# EAGLE design loggerV3.0 (EAGLE 6.6.0)
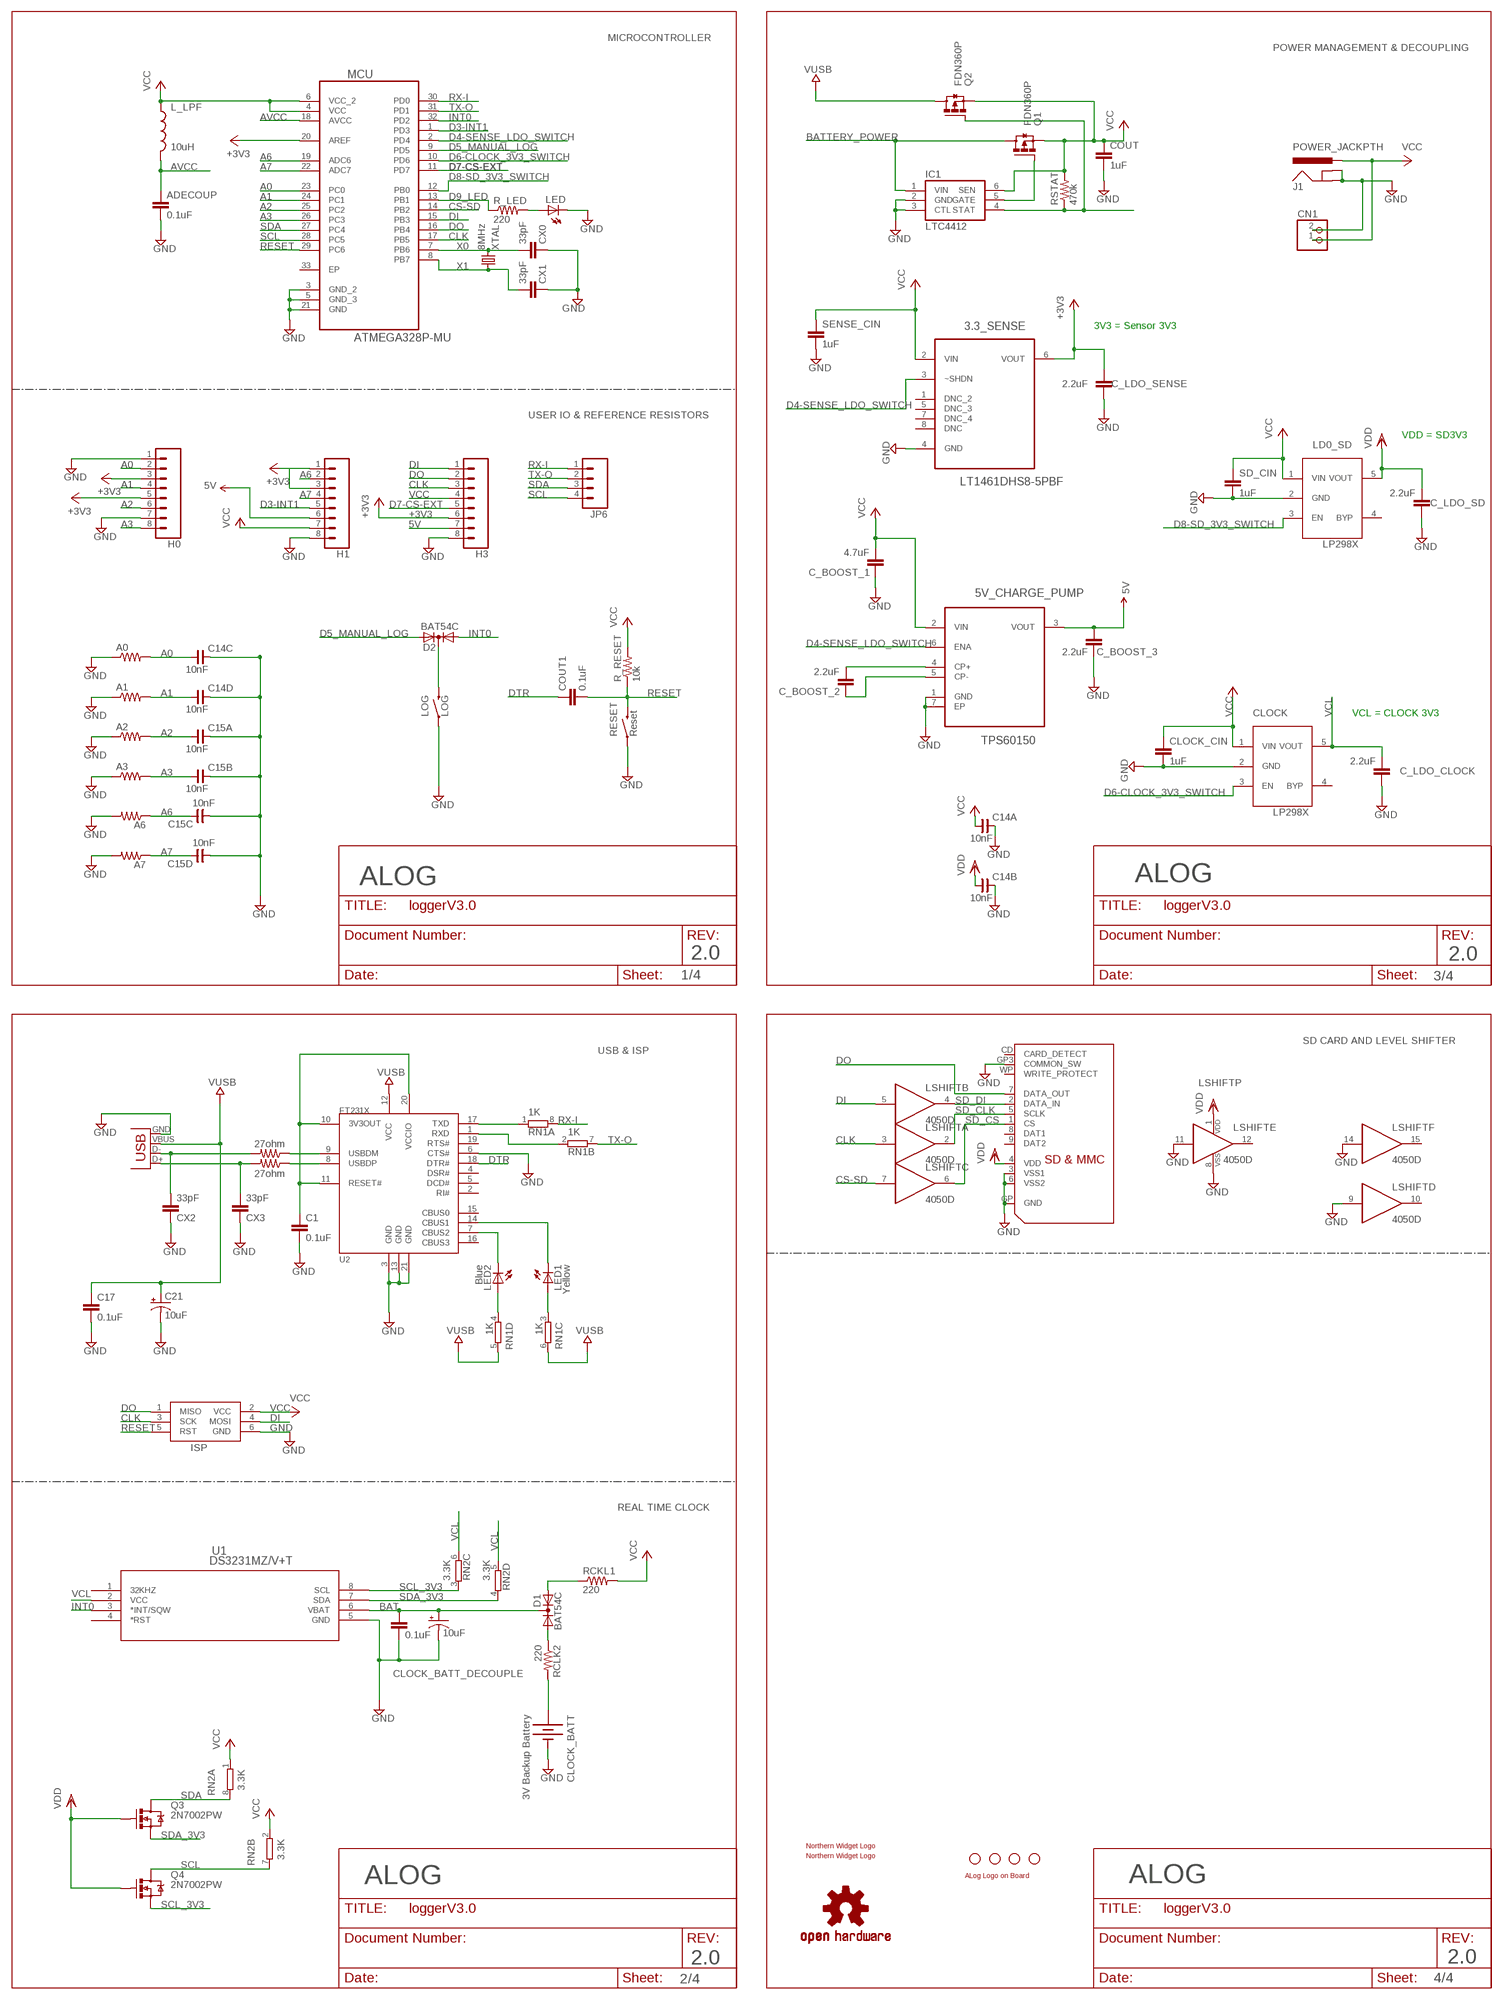
[diagram p0: schematic, sheet 1]

## Parts
3.3_SENSE  LT1461DHS8-5PBF  [SOIC127P600X175-8N]
5V_CHARGE_PUMP  TPS60150  TPS60150DRVR  [SON65P200X200X80-7N]
A0  R-US_0207/10  [0207/10]
A1  R-US_0207/10  [0207/10]
A2  R-US_0207/10  [0207/10]
A3  R-US_0207/10  [0207/10]
A6  R-US_0207/10  [0207/10]
A7  R-US_0207/10  [0207/10]
ADECOUP  0.1uF  C-EUC0603  [C0603]
C1  0.1uF  C-EUC0603  [C0603]
C14  10nF  CCA_ECJ-1206  [CECJ-1206]
C15  10nF  CCA_ECJ-1206  [CECJ-1206]
C17  0.1uF  C-EUC0603  [C0603]
C21  10uF  CAP_POL1206  [EIA3216]
C_BOOST_1  4.7uF  C-EUC0603  [C0603]
C_BOOST_2  2.2uF  C-EUC0603  [C0603]
C_BOOST_3  2.2uF  C-EUC0603  [C0603]
C_LDO_CLOCK  2.2uF  C-EUC0603  [C0603]
C_LDO_SD  2.2uF  C-EUC0603  [C0603]
C_LDO_SENSE  2.2uF  C-EUC0603  [C0603]
CLOCK  LP2985  LP298XS  [SOT23-5L]
CLOCK_BATT  3V Backup Battery  BATTERY12PTH  [BATTCON_12MM_PTH]
CLOCK_BATT_DECOUP  0.1uF  C-EUC0603  [C0603]
CLOCK_BATT_DECOUPLE  10uF  CAP_POL1206  [EIA3216]
CLOCK_CIN  1uF  C-EUC0603  [C0603]
CN1  JST_2PIN-THM  [JST-PH-2-THM]
COUT  1uF  C-EUC0603  [C0603]
COUT1  0.1uF  C-EUC0603  [C0603]
CX0  33pF  C-EUC0603  [C0603]
CX1  33pF  C-EUC0603  [C0603]
CX2  33pF  C-EUC0603  [C0603]
CX3  33pF  C-EUC0603  [C0603]
D1  BAT54C  DIODE_AC-CA_  [SOT23C]
D2  BAT54C  DIODE_AC-CA_  [SOT23C]
D+  27ohm  R-US_R0603  [R0603]
D-  27ohm  R-US_R0603  [R0603]
H0  M083.5MM-8  [SCREWTERMINAL-3.5MM-8]
H1  M083.5MM-8  [SCREWTERMINAL-3.5MM-8]
H3  M083.5MM-8  [SCREWTERMINAL-3.5MM-8]
IC1  LTC4412  LTC4412ES6  [TSOT23-6]
ISP  AVRISP-6  [AVRISP]
J1  POWER_JACKPTH  [POWER_JACK_PTH]
JP1  STAND-OFF  [STAND-OFF]
JP2  STAND-OFF  [STAND-OFF]
JP3  STAND-OFF  [STAND-OFF]
JP4  STAND-OFF  [STAND-OFF]
JP5  USB-B  USBPTH  [USB-B-PTH]
JP6  M04SCREW  [SCREWTERMINAL-3.5MM-4]
L_LPF  10uH  INDUCTOR0805  [0805]
LD0_SD  LP2985  LP298XS  [SOT23-5L]
LED  LED3MM  [LED3MM]
LED1  Yellow  LED0603  [LED-0603]
LED2  Blue  LED0603  [LED-0603]
LOG  LOG  SWITCH-MOMENTARY-2PTH  [TACTILE-PTH]
LOGO1  OSHW-LOGOM  [OSHW-LOGO-M]
LSHIFT  4050D  [SO16]
MCU  ATMEGA328P-MU  [QFN50P500X500X100-33N]
Q1  FDN360P  [SUPER-SOT3]
Q2  FDN360P  [SUPER-SOT3]
Q3  2N7002PW  MOSFET-NCHANNELSOT323  [SOT323]
Q4  2N7002PW  MOSFET-NCHANNELSOT323  [SOT323]
R_LED  220  R-US_R0603  [R0603]
R_RESET  10k  R-US_R0603  [R0603]
RCKL1  220  R-US_R0603  [R0603]
RCLK2  220  R-US_R0603  [R0603]
RESET  Reset  SWITCH-MOMENTARY-2PTH  [TACTILE-PTH]
RN1  1K  4R-N0603-ARC  [0603-ARC]
RN2  3.3K  4R-N0603-ARC  [0603-ARC]
RSTAT  470k  R-US_R0603  [R0603]
SD  SDMMC06132  [06132]
SD_CIN  1uF  C-EUC0603  [C0603]
SENSE_CIN  1uF  C-EUC0603  [C0603]
U1  DS3231MZ/V+T  [21-0041B_8]
U2  FT231X-Q  [QFN20]
U$1  NWLOGO  [NWLOGO]
U$2  ALOG_LOGO_V1_5.5MM  [ALOG_LOGO_V1_SMALL]
U$3  NWLOGO_MED  [NWLOGO_MED]
XTAL  8MHz  CRYSTALHC49UV  [HC49U-V]

## Nets
5V: 5V_CHARGE_PUMP.3(VOUT) C_BOOST_3.2 H1.6 H3.7
+3V3: 3.3_SENSE.6(VOUT) C_LDO_SENSE.2 H0.3 H0.5 H1.1 H1.3 H3.6 MCU.20(AREF)
A0: A0.2 C14.C1 H0.2 MCU.23(PC0)
A1: A1.2 C14.D1 H0.4 MCU.24(PC1)
A2: A2.2 C15.A1 H0.6 MCU.25(PC2)
A3: A3.2 C15.B1 H0.8 MCU.26(PC3)
A6: A6.1 C15.C2 H1.2 MCU.19(ADC6)
A7: A7.1 C15.D2 H1.4 MCU.22(ADC7)
AVCC: ADECOUP.1 L_LPF.2 MCU.18(AVCC)
BAT: CLOCK_BATT_DECOUP.1 CLOCK_BATT_DECOUPLE.A(+) D1.3(K) U1.6(VBAT)
BATTERY_POWER: IC1.1(VIN) Q1.3(D)
CLK: H3.3 ISP.3(SCK) LSHIFT.3(A:I) MCU.17(PB5)
CS-SD: LSHIFT.7(C:I) MCU.14(PB2)
D3-INT1: H1.5 MCU.1(PD3)
D4-SENSE_LDO_SWITCH: 3.3_SENSE.3(~SHDN) 5V_CHARGE_PUMP.6(ENA) MCU.2(PD4)
D5_MANUAL_LOG: D2.2(A2) MCU.9(PD5)
D6-CLOCK_3V3_SWITCH: CLOCK.3(EN) MCU.10(PD6)
D7-CS-EXT: H3.5 MCU.11(PD7)
D8-SD_3V3_SWITCH: LD0_SD.3(EN) MCU.12(PB0)
D9_LED: MCU.13(PB1) R_LED.1
DI: H3.1 ISP.4(MOSI) LSHIFT.5(B:I) MCU.15(PB3)
DO: H3.2 ISP.1(MISO) MCU.16(PB4) SD.7(DATA_OUT)
DTR: COUT1.1 U2.18(DTR#)
GND: 3.3_SENSE.4(GND) 5V_CHARGE_PUMP.1(GND) 5V_CHARGE_PUMP.7(EP) A0.1 A1.1 A2.1 A3.1 A6.2 A7.2 ADECOUP.2 C1.2 C14.A2 C14.B2 C14.C2 C14.D2 C15.A2 C15.B2 C15.C1 C15.D1 C17.2 C21.C(-) C_BOOST_1.1 C_BOOST_3.1 C_LDO_CLOCK.1 C_LDO_SD.1 C_LDO_SENSE.1 CLOCK.2(GND) CLOCK_BATT.GND(-) CLOCK_BATT_DECOUP.2 CLOCK_BATT_DECOUPLE.C(-) CLOCK_CIN.2 CN1.2 COUT.2 CX0.1 CX1.1 CX2.1 CX3.1 H0.1 H0.7 H1.8 H3.8 IC1.2(GND) IC1.3(CTL) ISP.6(GND) J1.GND J1.GNDBREAK JP5.GND LD0_SD.2(GND) LED.K(C) LOG.1 LSHIFT.8(P:VSS) LSHIFT.9(D:I) LSHIFT.11(E:I) LSHIFT.14(F:I) MCU.3(GND_2) MCU.5(GND_3) MCU.21(GND) RESET.1 SD.3(VSS1) SD.6(VSS2) SD.GP3(COMMON_SW) SD.GP(GND) SD_CIN.2 SENSE_CIN.2 U1.5(GND) U2.3(GND) U2.6(CTS#) U2.13(GND) U2.21(GND)
INT0: D2.1(A1) MCU.32(PD2) U1.3(*INT/SQW)
LED+: LED.A R_LED.2
N$1: D1.1(A1) RCLK2.1
N$2: CLOCK_BATT.VCC@1(+) RCLK2.2
N$3: CX3.2 D+.2 JP5.D+
N$4: CX2.2 D-.2 JP5.D-
N$5: LED2.A RN1.4
N$6: LED2.C U2.7(CBUS2)
N$7: IC1.4(STAT) Q2.1(G) RSTAT.1
N$8: IC1.5(GATE) Q1.1(G)
N$9: LED1.A RN1.3
N$10: LED1.C U2.14(CBUS1)
N$11: D2.3(K) LOG.3
N$13: D-.1 U2.9(USBDM)
N$14: 5V_CHARGE_PUMP.4(CP+) C_BOOST_2.2
N$15: 5V_CHARGE_PUMP.5(CP-) C_BOOST_2.1
N$16: D+.1 U2.8(USBDP)
N$17: C1.1 U2.10(3V3OUT) U2.11(RESET#) U2.20(VCCIO)
N$27: RN1.1 U2.17(TXD)
N$29: RN1.2 U2.1(RXD)
N$67: D1.2(A2) RCKL1.1
RESET: COUT1.2 ISP.5(RST) MCU.29(PC6) R_RESET.1 RESET.3
RX-I: JP6.1 MCU.30(PD0) RN1.8
SCL: JP6.4 MCU.28(PC5) Q4.3(D) RN2.7
SCL_3V3: Q4.2(S) RN2.3 U1.8(SCL)
SD_CLK: LSHIFT.2(A:O) SD.5(SCLK)
SD_CS: LSHIFT.6(C:O) SD.1(CS)
SD_DI: LSHIFT.4(B:O) SD.2(DATA_IN)
SDA: JP6.3 MCU.27(PC4) Q3.3(D) RN2.8
SDA_3V3: Q3.2(S) RN2.4 U1.7(SDA)
TX-O: JP6.2 MCU.31(PD1) RN1.7
VCC: 3.3_SENSE.2(VIN) 5V_CHARGE_PUMP.2(VIN) C14.A1 C_BOOST_1.2 CLOCK.1(VIN) CLOCK_CIN.1 CN1.1 COUT.1 H1.7 H3.4 IC1.6(SEN) ISP.2(VCC) J1.PWR L_LPF.1 LD0_SD.1(VIN) MCU.4(VCC) MCU.6(VCC_2) Q1.2(S) Q2.2(S) R_RESET.2 RCKL1.2 RN2.1 RN2.2 RSTAT.2 SD_CIN.1 SENSE_CIN.1
VCL: C_LDO_CLOCK.2 CLOCK.5(VOUT) RN2.5 RN2.6 U1.2(VCC)
VDD: C14.B1 C_LDO_SD.2 LD0_SD.5(VOUT) LSHIFT.1(P:VDD) Q3.1(G) Q4.1(G) SD.4(VDD)
VUSB: C17.1 C21.A(+) JP5.VBUS Q2.3(D) RN1.5 RN1.6 U2.12(VCC)
X0: CX0.2 MCU.7(PB6) XTAL.2
X1: CX1.2 MCU.8(PB7) XTAL.1
Unconnected: 3.3_SENSE.1(DNC_2) 3.3_SENSE.5(DNC_3) 3.3_SENSE.7(DNC_4) 3.3_SENSE.8(DNC) CLOCK.4(BYP) LD0_SD.4(BYP) LSHIFT.10(D:O) LSHIFT.12(E:O) LSHIFT.15(F:O) MCU.33(EP) SD.8(DAT1) SD.9(DAT2) SD.CD(CARD_DETECT) SD.WP(WRITE_PROTECT) U1.1(32KHZ) U1.4(*RST) U2.2(RI#) U2.4(DSR#) U2.5(DCD#) U2.15(CBUS0) U2.16(CBUS3) U2.19(RTS#)

## Notes on the sheet
- MICROCONTROLLER
- POWER MANAGEMENT & DECOUPLING
- 3V3 = Sensor 3V3
- USER IO & REFERENCE RESISTORS
- VDD = SD3V3
- VCL = CLOCK 3V3
- ALOG | ALOG
- 2.0 | 2.0
- 1/4 | 3/4
- SD CARD AND LEVEL SHIFTER
- USB & ISP
- REAL TIME CLOCK
- ALOG | ALOG
- 2.0 | 2.0
- 2/4 | 4/4

## Library data of the parts
3.3_SENSE = LTC_By_element14_Batch_1:LT1461DHS8-5PBF: Micropower Precision Low Dropout Series Voltage Reference Family; MPN: LT1461DHS8-5#PBF; OC_FARNELL: 1663431; OC_NEWARK: 57M4326; PACKAGE: SOIC-8; SUPPLIER: Linear Technology
5V_CHARGE_PUMP = ti_by_element14:TPS60150DRVR: Charge Pump Device; MPN: TPS60150DRVR; OC_FARNELL: -; OC_NEWARK: 45P8283; PACKAGE: SON-6; SUPPLIER: Texas Instruments
A0 A1-A3 A6 A7 R_LED = resistor:R-US_: RESISTOR, American symbol
ADECOUP C1 C17 C_BOOST_1-C_BOOST_3 C_LDO_CLOCK C_LDO_SD C_LDO_SENSE CX0 CX1-CX3 = resistor:C-EU: CAPACITOR, European symbol
C14 C15 = rc-master-smd:CCA_: CHIP CAP ARRAY
C21 CLOCK_BATT_DECOUPLE = SparkFun-Passives:CAP_POL: Capacitor Polarized These are standard SMD and PTH capacitors. Normally 10uF, 47uF, and 100uF in electrolytic and tantalum varieties. Always verify the external diameter of the through hole cap, it varies with capacity, voltage, and manufacturer. The EIA devices should be standard.
CLOCK LD0_SD = adafruit:LP298X
CLOCK_BATT = SparkFun:BATTERY: Battery Holders Various common sizes : AA, AAA, 20mm coin cell and 12mm coin cell.
CLOCK_BATT_DECOUP CLOCK_CIN COUT COUT1 SD_CIN SENSE_CIN = rcl:C-EU: CAPACITOR, European symbol
CN1 = adafruit:JST_2PIN: JST 2-Pin Connectors of various flavors SMT-RA (S2B-PH-SM4) 4UConnector #17311 SMT (B2B-PH-SM4) THM-RA (S2B-PH) THM (B2B-PH)
D1 D2 = semicon-smd-ipc:DIODE_AC-CA_: DUAL DIODE
D+ D- R_RESET RCKL1 RCLK2 RSTAT = rcl:R-US_: RESISTOR, American symbol
H0 H1 H3 = SparkFun:M08: Header 8 Standard 8-pin 0.1" header. Use with straight break away headers (SKU : PRT-00116), right angle break away headers (PRT-00553), swiss pins (PRT-00743), machine pins (PRT-00117), and female headers (PRT-00115).
IC1 = awickert:LTC4412*: Low Loss PowerPath Controller
ISP = adafruit:AVRISP: AVR ISP HEADER Standard 6 pin header for AVR programming
J1 = SparkFun:POWER_JACK: Power Jack This is the standard 5.5mm barrel jack for power. The PTH is the most common, proven, reliable, footprint. All others are experimental. The Slot footprint only works if the mill layer is transmitted to the PCB fab house so be warned. Spark Fun Electronics SKU : PRT-00119. Mating wall wart : TOL-00298 (and others)
JP1-JP4 = SparkFun:STAND-OFF: Stand Off This is the mechanical footprint for a #4 phillips button head screw. Use the keepout ring to avoid running the screw head into surrounding components. SKU : PRT-00447
JP5 = SparkFun-Connectors:USB: USB Connectors USB-B-PTH is fully proven SKU : PRT-00139/CONN-08278 USB-miniB is fully proven SKU : PRT-00587 USB-A-PCB is untested. USB-A-H is throughly reviewed, but untested. Spark Fun Electronics SKU : PRT-00437 USB-B-SMT is throughly reviewed, but untested. Needs silkscreen touching up. USB-A-S has not been used/tested USB-MB-H has not been used/tested USB-MICROB has been used. CONN-09505; PROD_ID: CONN-08278
JP6 = SparkFun-Connectors:M04: Header 4 Standard 4-pin 0.1" header. Use with straight break away headers (SKU : PRT-00116), right angle break away headers (PRT-00553), swiss pins (PRT-00743), machine pins (PRT-00117), and female headers (PRT-00115). Molex polarized connector foot print use with SKU : PRT-08231 with associated crimp pins and housings. 1MM SMD Version SKU: PRT-10208; PROD_ID: Combine 2x8399
L_LPF = SparkFun:INDUCTOR: Inductors Basic Inductor/Choke - 0603 and 1206. Footprints are not proven and vary greatly between part numbers.
LED = SparkFun:LED: LEDs Standard schematic elements and footprints for 5mm, 3mm, 1206, and 0603 sized LEDs. 5mm - Spark Fun Electronics SKU : COM-00529 (and others)
LED1 LED2 = SparkFun-LED:LED: LEDs Standard schematic elements and footprints for 5mm, 3mm, 1206, and 0603 sized LEDs. 5mm - Spark Fun Electronics SKU : COM-00529 (and others)
LOG RESET = SparkFun-Electromechanical:SWITCH-MOMENTARY-2: Various NO switches- pushbuttons, reed, etc; PROD_ID: SWCH-08441
LOGO1 = SparkFun-Aesthetics:OSHW-LOGO: Open Source Hardware Logo This logo indicates the piece of hardware it is found on incorporates a OSHW license and/or adheres to the definition of open source hardware found here: http://freedomdefined.org/OSHW
LSHIFT = 40xx:4050: Hex non-inverting BUFFER
MCU = Atmel_By_element14_Batch_1-00:ATMEGA328P-MU: Programmable Flash; MPN: ATMEGA328P-MU; OC_FARNELL: 1748522; OC_NEWARK: 26R2526; PACKAGE: QFN-32; SUPPLIER: Atmel
Q1 Q2 = transistor-power:FDN360P: Single P-Channel, PowerTrench (R) MOSFET Source: http://www.fairchildsemi.com/ds/FD/FDN360P.pdf
Q3 Q4 = SparkFun-DiscreteSemi:MOSFET-NCHANNEL: Generic NMOS footprint
RN1 RN2 = resistor-dil:4R-N: Array Chip Resistor Source: RS Component / Phycomp; OC_FARNELL: unknown; OC_NEWARK: unknown
SD = adafruit:SDMMC: SD MMC Card holder 4UCON part #06132 - easy to solder
U1 = Maxim-DS3231MZ_8-SOIC:DS3231MZ/V+T; MANUFACTURER_NAME: Maxim; MANUFACTURER_PART_NUMBER: DS3231MZ/V+T; VENDOR: Maxim
U2 = FT231X:FT231X
U$1 = awickert:NWLOGO
U$2 = awickert:ALOG_LOGO_V1_5.5MM
U$3 = awickert:NWLOGO_MED: Medium-sized Northern Widget logo
XTAL = SparkFun:CRYSTAL: Crystals Various standard crystals. Proven footprints. Spark Fun Electronics SKU : COM-00534

## Net classes
0 default: width 0.203 mm, drill 0.305 mm
1 power: width 0.305 mm, drill 0.508 mm
2 gnd: width 0.61 mm, drill 0.508 mm, clearance 0.203 mm
3 usbvcc: width 0.508 mm, drill 0.508 mm, clearance 0.152 mm
4 aref: width 0.406 mm

## Board
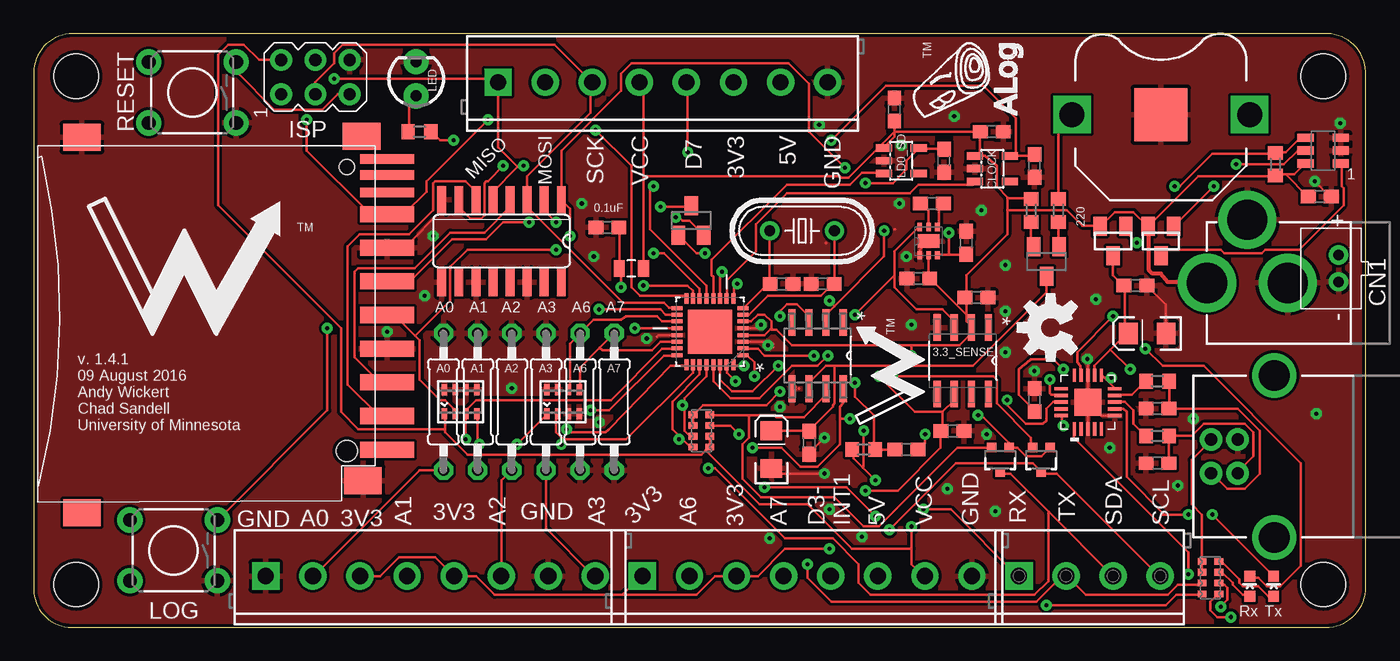
[diagram p1: board, top side]
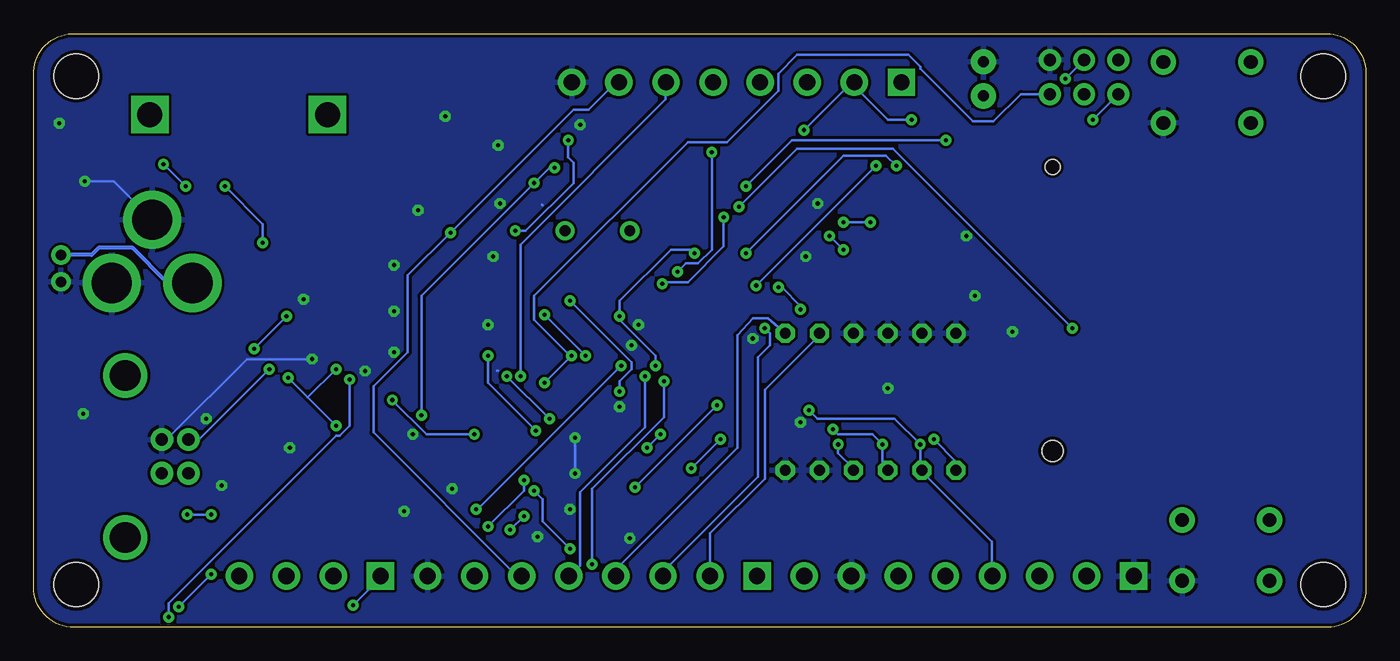
[diagram p2: board, bottom side, seen from below]

Size 99.05 x 44.12 mm. Coordinates in mm from the lower left corner, seen from the top.
Outline: 99.05,41.32 arc90 95.93,44.12 2.91,44.12 arc90 0,41.21 0,2.85 arc90 2.85,0 96.06,0 arc90 99.05,2.98 99.05,41.32
Copper layers (1*16): Top 0.035mm / dielectric 1.5mm / Bottom 0.035mm
Design rules "SparkFun *": minimum track width 8mil, minimum drill 12mil, track to track 8mil, track to pad 8mil, pad to pad 8mil, via to via 8mil, smd to smd 8mil, copper to edge 10mil, drill to drill 8mil, minimum pad ring 12mil, minimum via ring 10mil, stop-mask expansion 4mil, vias tented up to drill 25mil, thermal gap 10mil

### Footprints (pad centres in the part's own frame; a part is rotated, then mirrored left to right if it is on the bottom)
SOIC127P600X175-8N = smd 1.981 x 0.533: 1 -2.464,1.905; 2 -2.464,0.635; 3 -2.464,-0.635; 4 -2.464,-1.905; 5 2.464,-1.905; 6 2.464,-0.635; 7 2.464,0.635; 8 2.464,1.905
SON65P200X200X80-7N = smd 0.61 x 0.356: 1 -1.041,0.66; 2 -1.041,0; 3 -1.041,-0.66; 4 1.041,-0.66; 5 1.041,0; 6 1.041,0.66 | smd 0.991 x 1.6: 7 0,0
0207/10 = drill 0.813 octagon: 1 -5.08,0; 2 5.08,0
C0603 = smd 1.1 x 1: 1 -0.85,0; 2 0.85,0
CECJ-1206 = smd 0.406 x 0.813: A1 -1.2,-0.9; A2 -1.2,0.9; B1 -0.4,-0.9; B2 -0.4,0.9; C1 0.4,-0.9; C2 0.4,0.9; D1 1.2,-0.9; D2 1.2,0.9
EIA3216 = smd 1.4 x 1.6: A 1.4,0; C -1.4,0
SOT23-5L = smd 0.55 x 1.2: 1 -0.95,-1.3; 2 0,-1.3; 3 0.95,-1.3; 4 0.95,1.3; 5 -0.95,1.3
BATTCON_12MM_PTH = smd 3.962 x 3.962: GND 0,0 | drill 1.854 square: VCC@1 -6.604,0; VCC@2 6.604,0
JST-PH-2-THM = drill 0.8 pad 1.422: 1 1,0; 2 -1,0
SOT23C = smd 1 x 1.4: 1 -0.95,-1.1; 2 0.95,-1.1; 3 0,1.1
R0603 = smd 1 x 1.1: 1 -0.85,0; 2 0.85,0
SCREWTERMINAL-3.5MM-8 = drill 1.2 pad 2.032 square: 1 0,0 | drill 1.2 pad 2.032: 2 3.5,0; 3 7,0; 4 10.5,0; 5 14,0; 6 17.5,0; 7 21,0; 8 24.5,0
TSOT23-6 = smd 0.622 x 1.22: 1 -0.95,-1.31; 2 0,-1.31; 3 0.95,-1.31; 4 0.95,1.31; 5 0,1.31; 6 -0.95,1.31
AVRISP = drill 0.9 pad 1.626: 1 -1.27,2.54; 2 1.27,2.54; 3 -1.27,0; 4 1.27,0; 5 -1.27,-2.54; 6 1.27,-2.54
POWER_JACK_PTH = drill 2.997 pad 4.318: GND 0,7.7; GNDBREAK 4.7,10.7; PWR 0,13.7
STAND-OFF = hole 3.302: 0,0
USB-B-PTH = drill 0.914 pad 1.676: D+ 0,1.25; D- 1.981,1.25; GND 0,-1.25; VBUS 1.981,-1.25 | drill 2.286: S1 -2.718,-6.02; S2 -2.718,6.02
SCREWTERMINAL-3.5MM-4 = drill 1.2 pad 2.032 square: 1 0,0 | drill 1.2 pad 2.032: 2 3.5,0; 3 7,0; 4 10.5,0
0805 = smd 0.8 x 1.2: 1 -0.9,0; 2 0.9,0
LED3MM = drill 0.813 pad 1.88: A -1.27,0; K 1.27,0
LED-0603 = smd 0.8 x 0.8: A 0,-0.75; C 0,0.75
TACTILE-PTH = drill 1.016 pad 1.88: 1 -3.251,2.261; 2 3.251,2.261; 3 -3.251,-2.261; 4 3.251,-2.261
SO16 = smd 0.66 x 2.032: 1 -4.445,-3.073; 2 -3.175,-3.073; 3 -1.905,-3.073; 4 -0.635,-3.073; 5 0.635,-3.073; 6 1.905,-3.073; 7 3.175,-3.073; 8 4.445,-3.073; 9 4.445,3.073; 10 3.175,3.073; 11 1.905,3.073; 12 0.635,3.073; 13 -0.635,3.073; 14 -1.905,3.073; 15 -3.175,3.073; 16 -4.445,3.073
QFN50P500X500X100-33N = smd 0.813 x 0.305: 1 -2.464,1.753; 2 -2.464,1.245; 3 -2.464,0.762; 4 -2.464,0.254; 5 -2.464,-0.254; 6 -2.464,-0.762; 7 -2.464,-1.245; 8 -2.464,-1.753; 17 2.464,-1.753; 18 2.464,-1.245; 19 2.464,-0.762; 20 2.464,-0.254; 21 2.464,0.254; 22 2.464,0.762; 23 2.464,1.245; 24 2.464,1.753 | smd 0.305 x 0.813: 9 -1.753,-2.464; 10 -1.245,-2.464; 11 -0.762,-2.464; 12 -0.254,-2.464; 13 0.254,-2.464; 14 0.762,-2.464; 15 1.245,-2.464; 16 1.753,-2.464; 25 1.753,2.464; 26 1.245,2.464; 27 0.762,2.464; 28 0.254,2.464; 29 -0.254,2.464; 30 -0.762,2.464; 31 -1.245,2.464; 32 -1.753,2.464 | smd 3.251 x 3.251: 33 0,0
SUPER-SOT3 = smd 1 x 1.4: 1 -0.95,-1.1; 2 0.95,-1.1; 3 0,1.1
SOT323 = smd 0.7 x 0.7: 1 -0.65,-0.925; 2 0.65,-0.925; 3 0,0.925
0603-ARC = smd 0.5 x 0.65: 1 -1.2,-0.625; 2 -0.4,-0.625; 3 0.4,-0.625; 4 1.2,-0.625; 5 1.2,0.625; 6 0.4,0.625; 7 -0.4,0.625; 8 -1.2,0.625
06132 = smd 1.2 x 4: 1 6.9,0.9; 2 4.4,0.9; 3 1.9,0.9; 4 -0.6,0.9; 5 -3.1,0.9; 6 -5.6,0.9; 7 -8.1,0.9; 9 9.4,0.9 | smd 0.7 x 4: 8 -9.7,0.9; CD -11,0.9; WP -12.2,0.9 | smd 2 x 2.8: GP -13.8,-21.8; GP2 14.1,-21.8; GP3 11.7,-0.9; GP4 -13.9,-1 | hole 1.1: -11.6,-2.1 | hole 1.6: 9.5,-2.1
21-0041B_8 = smd 1.981 x 0.533: 1 -2.464,1.905; 2 -2.464,0.635; 3 -2.464,-0.635; 4 -2.464,-1.905; 5 2.464,-1.905; 6 2.464,-0.635; 7 2.464,0.635; 8 2.464,1.905
QFN20 = smd 1 x 0.25: 1 -2.032,0.968; 2 -2.032,0.468; 3 -2.032,-0.032; 4 -2.032,-0.532; 5 -2.032,-1.032; 11 1.968,-1.032; 12 1.968,-0.532; 13 1.968,-0.032; 14 1.968,0.468; 15 1.968,0.968 | smd 0.25 x 1: 6 -1.032,-2.032; 7 -0.532,-2.032; 8 -0.032,-2.032; 9 0.468,-2.032; 10 0.968,-2.032; 16 0.968,1.968; 17 0.468,1.968; 18 -0.032,1.968; 19 -0.532,1.968; 20 -1.032,1.968 | smd 2 x 2: 21 -0.032,-0.032
HC49U-V = drill 0.813: 1 -2.413,0; 2 2.413,0

### Placement (x,y rotation side)
3.3_SENSE  69.08,19.81 270 top
5V_CHARGE_PUMP  66.54,28.7 90 top
A0  30.47,16.76 270 top
A1  33.01,16.76 270 top
A2  35.55,16.76 270 top
A3  38.09,16.76 270 top
A6  40.63,16.76 270 top
A7  43.17,16.76 270 top
ADECOUP  42.66,29.72 180 top
C1  74.41,16.89 90 top
C14  31.74,16.76 0 top
C15  39.36,16.76 0 top
C17  81.91,25.4 0 top
C21  82.79,21.84 180 top
C_BOOST_1  65.78,25.91 0 top
C_BOOST_2  66.79,31.5 0 top
C_BOOST_3  69.33,28.57 270 top
C_LDO_CLOCK  74.41,34.29 90 top
C_LDO_SD  67.68,34.67 90 top
C_LDO_SENSE  68.32,14.61 180 top
CLOCK  71.28,34.09 270 top
CLOCK_BATT  83.81,38.1 0 top
CLOCK_BATT_DECOUP  57.65,13.72 270 top
CLOCK_BATT_DECOUPLE  54.85,13.21 90 top
CLOCK_CIN  71.24,36.83 0 top
CN1  97.02,26.67 90 top
COUT  95.62,32 0 top
COUT1  64.89,13.21 180 top
CX0  58.66,25.53 0 top
CX1  55.62,25.53 180 top
CX2  83.56,16.26 0 top
CX3  83.56,12.19 0 top
D1  75.3,27.18 180 top
D2  48.89,30.23 0 top
D+  83.56,14.22 0 top
D-  83.56,18.29 0 top
H0  17.26,3.81 0 top
H1  45.26,3.81 0 top
H3  34.53,40.51 0 top
IC1  95.88,35.43 90 top
ISP  20.94,40.89 90 top
J1  100.94,25.59 90 top
JP1  3.17,3.17 0 top
JP2  95.88,40.96 90 top
JP3  95.88,3.17 90 top
JP4  3.17,40.96 0 top
JP5  89.52,12.7 180 top
JP6  73.26,3.81 0 top
L_LPF  44.44,26.67 180 top
LD0_SD  64.51,34.67 270 top
LED  28.44,40.77 90 top
LED1  90.41,3.05 0 top
LED2  92.19,3.05 0 top
LOG  10.4,5.71 180 top
LOGO1  75.61,22.27 90 top
LSHIFT  34.79,28.7 180 top
MCU  50.28,21.97 180 top
Q1  83.81,28.7 180 top
Q2  80.25,28.7 180 top
Q3  71.87,12.45 180 top
Q4  74.92,12.45 180 top
R_LED  28.69,36.83 180 top
R_RESET  61.71,13.21 180 top
RCKL1  74.16,30.99 90 top
RCLK2  76.19,30.99 90 top
RESET  11.8,39.75 180 top
RN1  87.49,3.68 90 top
RN2  49.65,14.61 90 top
RSTAT  92.32,34.42 270 top
SD  25.39,22.61 270 top
SD_CIN  64,38.48 90 top
SENSE_CIN  70.09,24.51 0 top
U1  58.28,20.19 270 top
U2  78.35,16.76 90 top
U$1  11.17,26.42 0 top
U$2  68.32,40.77 90 top
U$3  63.24,18.67 90 top
XTAL  57.14,29.46 0 top

### Tracks (layer width: path | path; a pad name or v marks a point on that pad's centre or on a via)
5V  (via drill 0.3)
  Top 0.203: 68.06,27.69 69.33,27.69 C_BOOST_3.2 | 68.06,27.69 67.3,27.69 5V_CHARGE_PUMP.3 | v68.06,29.34 68.06,27.69
  Bottom 0.203: H3.7 55.74,40.51 57.77,38.48 58.92,38.48 v68.06,29.34 71.24,26.16 71.24,20.45 73.78,17.91 73.78,14.48 63.11,3.81 H1.6
+3V3  (via drill 0.3)
  Top 0.203: H0.3 25.77,3.81 27.17,5.21 29.83,5.21 31.23,3.81 H0.5 32.88,3.81 34.28,2.41 43.8,2.41 43.87,2.48 | 43.87,2.48 45.2,3.81 H1.1 | 67.55,16 67.55,14.61 C_LDO_SENSE.2 67.43,14.61 67.43,13.34 64.25,10.16 v61.84,10.16 | 67.55,16 68.44,16.89 3.3_SENSE.6 | v62.86,18.67 65.52,16 67.55,16 | v44.69,22.23 MCU.20 | 43.87,2.48 43.93,2.41 49.27,2.41 50.66,3.81 H1.3 53.84,3.81 55.87,5.84 v59.17,5.84
  Bottom 0.203: v62.86,18.67 62.86,28.45 52.06,39.24 52.06,40.51 H3.6 | v44.69,22.23 44.31,21.84 44.31,20.95 45.2,20.07 45.2,11.18 52.19,4.19 52.19,3.81 H1.3 | v59.17,5.84 61.2,7.87 61.2,9.53 v61.84,10.16
A0  (via drill 0.3)
  Top 0.203: MCU.23 47.74,20.7 46.73,20.7 42.92,16.89 32.88,16.89 32.25,16.26 32.25,15.88 C14.C1 32.12,15.75 v32.12,13.97 | A0.2 28.69,11.68 20.82,3.81 H0.2
  Bottom 0.203: v32.12,13.97 30.47,12.32 A0.2
A1  (via drill 0.3)
  Top 0.203: v33.14,13.59 33.01,13.72 33.01,15.75 C14.D1 | v41.39,16.13 42.79,16.13 46.85,20.19 47.74,20.19 MCU.24
  Bottom 0.203: v41.39,16.13 40.76,15.49 35.04,15.49 v33.14,13.59 33.14,11.81 A1.2 33.14,11.68 27.8,6.35 27.8,3.81 H0.4
A2  (via drill 0.3)
  Top 0.203: v35.93,13.59 38.09,15.75 C15.A1 | v39.61,14.73 39.87,14.48 42.54,14.48 42.79,14.73 47.36,19.43 48.5,19.43 MCU.25 | A2.2 34.79,10.92 34.79,3.81 H0.6
  Bottom 0.203: A2.2 35.93,12.06 v35.93,13.59 36.69,14.35 39.23,14.35 v39.61,14.73
A3  (via drill 0.3)
  Top 0.203: 39.3,14.03 39.36,13.97 44.06,13.97 49.01,18.92 49.01,19.43 MCU.26 | 39.3,14.03 38.85,14.48 38.85,15.75 C15.B1 | A3.2 38.09,7.37 41.65,3.81 H0.8 | v39.23,13.59 39.23,13.97 39.3,14.03
  Bottom 0.203: v39.23,13.59 39.23,12.95 38.09,11.81 A3.2
A6
  Top 0.203: C15.C2 39.87,17.78 39.87,21.08 A6.1 41.65,22.86 43.68,22.86 44.06,23.11 46.34,23.11 46.73,22.73 MCU.19
  Bottom 0.203: A6.1 40.63,21.72 44.69,17.65 44.69,11.05 48.76,6.99 H1.2
A7
  Top 0.203: A7.1 42.09,20.77 | 42.09,20.77 40.63,19.3 40.63,17.78 C15.D2 | MCU.22 46.6,21.21 45.96,20.57 42.28,20.57 42.09,20.77
  Bottom 0.203: A7.1 44.44,22.99 45.58,22.99 46.73,21.72 46.73,13.34 55.74,4.32 55.74,3.81 H1.4
AVCC  (via drill 0.3)
  Top 0.203: 47.87,23.24 MCU.18 47.74,23.24 46.98,23.24 46.6,23.62 v42.03,23.62 | v43.68,25.27 43.68,26.54 L_LPF.2 | L_LPF.2 43.55,29.72 ADECOUP.1 | L_LPF.2
  Bottom 0.203: v43.68,25.27 43.42,25.27 42.03,23.88 v42.03,23.62
BAT
  Top 0.203: 57.65,14.61 CLOCK_BATT_DECOUPLE.A | D1.3 75.3,24.89 69.84,19.43 59.55,19.43 | 59.55,19.43 58.92,19.43 57.65,18.16 U1.6 | 57.65,14.61 59.43,16.38 59.43,16.51 59.55,16.64 59.55,19.43 | 57.65,14.61 CLOCK_BATT_DECOUP.1
BATTERY_POWER
  Top 0.203: IC1.1 97.27,34.42 97.27,32.77 97.4,32.64 97.4,31.37 94.1,28.07 91.56,28.07 91.3,27.81 88.51,27.81 88.25,28.07 84.19,28.07 83.81,27.69 Q1.3
CLK
  Top 0.203: MCU.17 47.74,23.75 47.23,23.75 46.85,24.13 43.8,24.13 36.69,31.24 LSHIFT.3 36.69,33.53 41.39,38.23 41.39,40.51 H3.3 38.73,43.31 22.98,43.31 22.34,42.67 22.34,41.91 20.94,40.51 ISP.3
CS-SD  (via drill 0.3)
  Top 0.203: MCU.14 49.52,25.15 46.85,27.81 v46.09,27.81 | v34.91,34.29 33.77,33.15 33.65,33.15 33.52,33.02 33.52,30.61 33.26,30.35 32.5,30.35 31.61,31.24 LSHIFT.7
  Bottom 0.203: v46.09,27.81 38.85,35.05 35.68,35.05 v34.91,34.29
D3-INT1  (via drill 0.3)
  Top 0.203: v53.58,18.67 53.58,19.68 53.08,20.19 52.82,20.19 MCU.1
  Bottom 0.203: v53.58,18.67 53.58,14.86 58.41,10.03 58.41,4.57 59.17,3.81 H1.5
D4-SENSE_LDO_SWITCH  (via drill 0.3)
  Top 0.203: 64,26.16 64,25.27 65.65,23.62 67.55,23.62 68.44,22.73 3.3_SENSE.3 | 64,26.16 64,27.94 65.78,29.72 5V_CHARGE_PUMP.6 | v58.03,20.19 54.35,20.19 53.84,20.7 52.82,20.7 MCU.2 | 64,26.16 v61.08,23.24
  Bottom 0.203: v61.08,23.24 v58.03,20.19
D5_MANUAL_LOG  (via drill 0.3)
  Top 0.203: v52.31,25.53 52.06,25.27 52.06,24.51 MCU.9 | v47.74,30.48 48,30.48 48.25,30.23 48.76,30.23 49.77,29.21 D2.2
  Bottom 0.203: v52.31,25.53 52.19,25.65 50.41,25.65 47.74,28.32 v47.74,30.48
D6-CLOCK_3V3_SWITCH
  Top 0.203: MCU.10 51.55,24.51 51.55,25.78 53.71,27.94 53.71,29.97 56,32.26 65.14,32.26 65.78,32.89 69.84,32.89 69.97,33.02 CLOCK.3
D7-CS-EXT  (via drill 0.3)
  Top 0.203: MCU.11 51.04,26.29 v51.17,26.42 | v48.63,35.31 48.63,40.51 H3.5
  Bottom 0.203: v51.17,26.42 50.54,27.05 49.65,27.05 48.63,28.07 v48.63,35.31
D8-SD_3V3_SWITCH
  Top 0.203: MCU.12 50.54,26.04 50.41,26.16 50.41,27.3 56,32.89 60.7,32.89 61.59,33.78 63.11,33.78 LD0_SD.3
D9_LED  (via drill 0.3)
  Top 0.203: MCU.13 50.03,25.4 45.84,29.59 45.84,32.51 v46.09,32.77 | v31.23,36.2 30.22,36.2 29.58,36.83 R_LED.1
  Bottom 0.203: v46.09,32.77 42.66,36.2 v31.23,36.2
DI  (via drill 0.3)
  Top 0.203: v22.34,40.77 34.28,40.77 H3.1 34.53,35.69 36,34.23 | v45.33,25.4 48.63,25.4 49.01,25.02 49.01,24.51 MCU.15 | v36.44,34.29 36.06,34.29 36,34.23 | 36,34.23 34.15,32.38 LSHIFT.5
  Bottom 0.203: v22.34,40.77 ISP.4 | v36.44,34.29 v45.33,25.4
DO  (via drill 0.3)
  Top 0.203: v20.31,37.72 20.31,35.43 25.01,30.73 26.28,30.73 SD.7 26.41,30.73 27.55,30.73 29.2,32.38 29.2,33.15 v33.77,37.72 | v41.77,36.96 44.44,34.29 44.44,25.27 45.08,24.64 48.5,24.64 MCU.16
  Bottom 0.203: v20.31,37.72 ISP.1 | v41.77,36.96 38.22,40.51 H3.2 38.22,40.39 35.55,37.72 v33.77,37.72
DTR  (via drill 0.3)
  Top 0.203: v72.38,16.89 72.38,16.51 73.78,15.11 75.05,15.11 75.3,15.37 75.3,16.26 75.81,16.76 76.32,16.76 U2.18 | v66.28,14.35 66.28,13.72 65.78,13.21 COUT1.1
  Bottom 0.203: v72.38,16.89 69.84,14.35 v66.28,14.35
GND  (via drill 0.3)
  Top 0.203: 53.84,21.21 54.35,21.21 v54.6,20.95 | 53.84,21.21 53.4,21.21 53.2,21.21 MCU.3 | v95.24,33.15 96.38,32 COUT.2 | LSHIFT.8 30.34,30.99 27.68,28.32 26.41,28.32 SD.6 | 5V_CHARGE_PUMP.7 65.9,28.07 65.9,27.69 5V_CHARGE_PUMP.1 | v58.79,14.1 57.65,12.95 CLOCK_BATT_DECOUP.2 | v58.79,11.43 55.11,11.43 54.85,11.68 CLOCK_BATT_DECOUPLE.C | MCU.21 46.47,21.72 46.34,21.59 | 56.89,17.78 56.89,17.73 | U1.5 56.63,17.65 56.63,17.91 U1.5 | U1.5 | 56.51,17.78 U1.5 | 54.98,21.08 v54.6,20.95 | 54.98,20.83 v54.6,20.95 | 53.84,21.21 | MCU.5 53.84,22.23 v54.09,22.48 | 64,29.59 64.05,29.59 | 58.92,28.57 58.89,28.55 | 85.08,10.16 85.08,10.15 | v78.35,19.94 78.38,19.91 U2.13 U2.21 | 54.6,20.7 v54.6,20.95 | U1.5 56.38,17.78 U1.5 | C21.C 84.19,23.96 C17.2 | U2.3 U2.21 | U2.21 79.38,15.73 U2.6
  Bottom 0.203: v95.24,33.15 93.08,33.15 90.29,30.35 J1.GNDBREAK | v58.79,11.43 v58.79,14.1 | 64.51,19.05 64.58,19.08 | 61.2,31.37 61.25,31.41 | v78.35,19.94 83.17,19.94 88.89,14.22 89.14,14.22 JP5.GND
  Bottom 1.016: JP5.GND 89.55,13.95
  other vias: 26.28,21.97 29.71,29.08 40.76,31.5 55.49,16.38 64.38,31.5 72.25,23.5 70.47,30.99 64.89,27.56 65.27,22.48 72.25,26.92 74.41,19.05 70.86,14.35 72.25,20.45 58.41,37.34 64.51,35.81 68.44,37.97 78.98,24.38 67.93,10.29 71.49,8.64 97.14,37.47 95.37,15.88 86.22,15.49 80,13.34 85.08,10.54 45.58,21.46 29.07,24.64 61.59,6.73 59.17,8.76 41.65,27.56 54.73,6.6 42.03,15.24 35.55,17.78
  pour Bottom: -0.33,44.45 -0.33,-0.32 99.37,-0.32 99.37,44.45
  pour Top: -0.65,44.77 -0.65,-0.64 99.68,-0.64 99.68,44.77
INT0  (via drill 0.3)
  Top 0.203: v52.82,19.43 52.06,19.43 MCU.32 | v55.49,23.11 55.49,23.5 56,24 56.76,24 57.65,23.11 U1.3 | v49.9,27.81 49.27,27.81 48,29.08 D2.1
  Bottom 0.203: v52.82,19.43 52.82,20.19 55.49,22.86 v55.49,23.11 55.49,24.26 51.68,28.07 50.16,28.07 v49.9,27.81
LED+
  Top 0.203: LED.A 27.93,38.99 27.93,36.83 R_LED.2
N$1
  Top 0.203: RCLK2.1 76.19,28.32 D1.1
N$2
  Top 0.203: RCLK2.2 76.19,37.08 CLOCK_BATT.VCC@1
N$3
  Top 0.203: JP5.D+ 89.52,11.56 90.67,12.7 90.67,14.48 90.03,15.11 86.98,15.11 86.1,14.22 D+.2 CX3.2
N$4
  Top 0.203: 84.44,16.26 84.44,18.29 D-.2 | 84.44,16.26 89.52,16.26 91.18,14.61 91.18,11.43 90.03,10.29 88.76,10.29 87.62,11.43 JP5.D- | 84.44,16.26 CX2.2
N$5
  Top 0.203: LED2.A 91.8,2.3 91.05,3.05 89.91,3.05 89.65,3.3 89.65,3.56 88.38,4.83 88.13,4.83 RN1.4
N$6  (via drill 0.3)
  Top 0.203: v87.62,8.38 LED2.C | 83.94,8.38 84.06,8.38 | 84.06,8.38 v85.84,8.38 | U2.7 80.38,16.26 81.02,16.26 81.27,16 81.27,11.18 84.06,8.38
  Bottom 0.203: v85.84,8.38 v87.62,8.38
N$7  (via drill 0.3)
  Top 0.203: IC1.4 94.48,36.32 94.1,36.32 93.08,35.31 92.32,35.31 RSTAT.1 92.32,35.18 87.62,35.18 85.21,32.77 v84.83,32.77 | v82.03,28.57 81.27,29.34 81.27,29.72 Q2.1
  Bottom 0.203: v82.03,28.57 82.03,29.97 v84.83,32.77
N$8  (via drill 0.3)
  Top 0.203: IC1.5 93.97,35.43 92.95,34.42 v89.4,34.42 | v87.75,32.77 84.83,29.84 Q1.1
  Bottom 0.203: v87.75,32.77 v89.4,34.42
N$9
  Top 0.203: RN1.3 88.13,4.06 88.38,4.06 89.14,3.3 89.14,3.17 89.91,2.41 90.41,2.41 LED1.A
N$10  (via drill 0.3)
  Top 0.203: v82.67,20.7 83.94,19.43 86.98,19.43 94.22,12.19 94.22,4.57 92.7,3.05 91.68,3.05 91.05,3.68 90.41,3.68 LED1.C | v80.25,23.11 77.59,20.45 77.59,19.68 77.84,19.43 77.84,18.8 U2.14
  Bottom 0.203: v80.25,23.11 v82.67,20.7
N$11  (via drill 0.3)
  Top 0.203: v46.6,31.24 48.89,31.24 D2.3 | v21.83,22.23 21.83,16.13 13.71,8 LOG.3
  Bottom 0.203: v46.6,31.24 42.28,35.56 35.17,35.56 v21.83,22.23
N$13
  Top 0.203: U2.9 80.38,17.27 81.65,17.27 82.67,18.29 D-.1
N$14
  Top 0.203: 5V_CHARGE_PUMP.4 67.3,29.84 67.3,31.24 67.55,31.5 C_BOOST_2.2
N$15
  Top 0.203: 5V_CHARGE_PUMP.5 66.54,30.99 66.03,31.5 C_BOOST_2.1
N$16
  Top 0.203: U2.8 80.38,16.76 81.14,16.76 81.78,16.13 81.78,15.11 82.67,14.22 D+.1
N$17  (via drill 0.3)
  Top 0.203: v76.57,14.99 76.44,15.11 76.44,15.62 U2.20 | 79.62,18.54 v80.13,18.54 | 79.62,18.54 79.49,18.67 U2.11 | 79.62,18.54 80.38,17.78 U2.10 | C1.1 74.41,16.13 73.27,17.27 73.27,19.18 74.09,19.89 74.16,19.94 75.81,19.94 v76.57,19.18
  Bottom 0.203: v80.13,18.54 78.67,17.08 | 78.67,17.08 v76.57,14.99 | 78.67,17.08 v76.57,19.18
N$27  (via drill 0.3)
  Top 0.203: v89.02,0.76 88,0.76 87.49,1.27 87.49,1.91 88,2.41 RN1.1 | v75.55,18.41 75.55,17.4 75.68,17.27 76.32,17.27 U2.17
  Bottom 0.203: v89.02,0.76 89.02,1.78 76.57,14.22 76.32,14.22 75.55,14.99 v75.55,18.41
N$29  (via drill 0.3)
  Top 0.203: v88.25,1.52 88.76,2.03 88.76,2.92 88.51,3.17 88.13,3.17 RN1.2 | v85.84,3.94 85.84,5.59 77.33,14.1 77.33,14.73 U2.1
  Bottom 0.203: v85.84,3.94 v88.25,1.52
N$67
  Top 0.203: RCKL1.1 74.16,28.45 74.28,28.32 D1.2
RESET  (via drill 0.3)
  Top 0.203: ISP.5 22.6,39.62 21.45,38.48 17.9,38.48 15.1,41.27 15.1,41.91 RESET.3 | MCU.29 50.54,18.29 51.81,17.02 53.97,17.02 56.38,19.43 58.28,19.43 v59.05,20.19 | v61.08,18.16 61.08,17.14 62.47,15.75 62.47,13.21 R_RESET.1 COUT1.2
  Bottom 0.203: v61.08,18.16 v59.05,20.19 59.17,20.19 61.84,22.86 61.84,24.64 50.41,36.07 47.49,36.07 43.68,39.88 43.68,41.15 42.28,42.55 34.03,42.55 33.14,41.66 33.14,41.53 29.2,37.59 27.68,37.59 25.64,39.62 ISP.5
RX-I  (via drill 0.3)
  Top 0.203: v75.3,1.65 84.19,1.65 84.95,2.41 86.86,2.41 RN1.8 | MCU.30 51.04,18.41 51.93,17.53 53.46,17.53 v55.36,19.43 | v66.16,8.76 68.19,8.76 73.14,3.81 JP6.1
  Bottom 0.203: v75.3,1.65 73.14,3.81 JP6.1 | v55.36,19.43 66.03,8.76 v66.16,8.76
SCL  (via drill 0.3)
  Top 0.203: 48.38,16.51 48.38,17.02 50.03,18.67 MCU.28 | 48.38,16.51 48.38,14.61 48.76,14.22 49.01,14.22 RN2.7 | JP6.4 83.68,3.81 76.06,11.43 74.92,11.43 Q4.3 74.92,11.56 74.28,12.19 68.57,12.19 v63.62,7.24 | v48.25,16.51 48.38,16.51 | v54.35,10.41 60.44,10.41 v62.6,8.26
  Bottom 0.203: v54.35,10.41 v48.25,16.51 | v63.62,7.24 v62.6,8.26
SCL_3V3  (via drill 0.3)
  Top 0.203: v52.44,14.35 51.81,14.99 50.28,14.99 RN2.3 | v53.46,13.34 55.62,13.34 57.01,11.94 58.28,11.94 59.93,13.59 59.93,15.49 | 59.93,15.49 59.93,16.38 60.19,16.64 U1.8 | v63.87,18.67 71.36,18.67 71.62,18.41 71.62,16.64 74.16,14.1 74.16,13.46 Q4.2 | 59.93,15.49 v60.7,15.49
  Bottom 0.203: v53.46,13.34 v52.44,14.35 | v60.7,15.49 v63.87,18.67
SD_CLK  (via drill 0.3)
  Top 0.203: LSHIFT.2 37.96,30.99 v38.85,30.1 | v36.82,30.1 34.91,30.1 33.65,28.83 31.1,28.83 28.06,25.78 26.41,25.78 SD.5
  Bottom 0.203: v36.82,30.1 v38.85,30.1
SD_CS
  Top 0.203: LSHIFT.6 32.88,32.38 32.12,33.15 29.83,33.15 29.71,33.02 29.71,30.99 27.93,29.21 24.25,29.21 23.36,28.32 23.36,18.03 25.64,15.75 26.28,15.75 SD.1
SD_DI
  Top 0.203: LSHIFT.4 35.42,31.24 33.52,29.34 30.98,29.34 28.31,26.67 24.12,26.67 23.87,26.42 23.87,20.07 25.64,18.29 26.28,18.29 SD.2
SDA  (via drill 0.3)
  Top 0.203: 48.06,14.16 47.49,14.73 47.49,16.76 49.52,18.8 MCU.27 | 48.06,14.16 48.76,13.46 49.01,13.46 RN2.8 | 75.49,8.57 JP6.3 | 75.49,8.57 72.63,11.43 71.87,11.43 Q3.3 | v48,13.97 48,14.1 48.06,14.16 | v50.16,11.81 50.66,11.81 55.87,6.6 59.43,6.6 61.33,4.7 61.33,3.3 62.22,2.41 74.41,2.41 75.43,3.43 75.43,8.51 75.49,8.57
  Bottom 0.203: v50.16,11.81 v48,13.97
SDA_3V3
  Top 0.203: 53.2,15.75 55.11,15.75 55.23,15.62 57.27,15.62 58.92,17.27 U1.7 | 53.2,15.75 50.28,15.75 RN2.4 | 53.2,15.75 53.2,14.1 52.7,13.59 52.7,11.05 54.09,9.65 59.55,9.65 61.71,7.49 62.86,7.49 68.7,13.34 71.11,13.34 Q3.2
TX-O  (via drill 0.3)
  Top 0.203: RN1.7 86.86,3.17 85.08,3.17 84.32,2.41 78.22,2.41 76.82,3.81 JP6.2 76.44,3.81 74.54,1.91 59.3,1.91 57.52,3.68 v57.52,4.7 | v52.19,18.29 51.55,18.92 51.55,19.43 MCU.31
  Bottom 0.203: v52.19,18.29 52.19,15.62 57.52,10.29 v57.52,4.7
VCC  (via drill 0.3)
  Top 0.203: RN2.2 50.28,14.1 50.28,13.46 RN2.1 50.16,13.34 49.96,13.14 | 5V_CHARGE_PUMP.2 66.54,25.91 C_BOOST_1.2 66.66,25.91 69.33,23.24 | 69.33,23.24 69.33,22.73 69.71,22.35 3.3_SENSE.2 69.71,21.84 68.82,20.95 65.27,20.95 | 69.33,23.24 69.33,24.51 | 45.33,33.53 45.33,40.26 45.08,40.51 H3.4 | 45.33,33.53 45.33,26.67 L_LPF.1 | 70.35,36.83 70.35,35.31 70.09,35.05 CLOCK.1 70.73,35.05 71.62,34.29 71.62,32.77 72.44,31.94 | 64,36.83 64,36.45 63.24,35.69 LD0_SD.1 | 64,36.83 SD_CIN.1 | 64,36.83 70.35,36.83 | 70.35,36.83 CLOCK_CIN.1 | 93.08,33.66 93.72,33.66 94.48,34.42 IC1.6 | 93.08,33.66 92.32,33.66 RSTAT.2 92.32,33.53 86.6,33.53 82.92,29.84 Q1.2 | 93.08,33.66 94.73,32 COUT.1 | 72.44,31.94 72.51,31.88 74.16,31.88 RCKL1.2 | 45.33,33.53 59.93,33.53 60.06,33.4 60.57,33.4 64,36.83 | 69.33,24.51 69.33,26.16 72.38,29.21 72.38,30.99 | 72.38,30.99 72.38,31.88 72.44,31.94 | 69.33,24.51 SENSE_CIN.1 | Q1.2 82.79,29.84 81.78,30.86 80.38,30.86 79.36,29.84 Q2.2 79.24,29.84 77.97,29.84 76.82,30.99 72.38,30.99 | 82.92,29.72 Q1.2 | 87.24,25.65 J1.PWR | MCU.4 54.35,21.72 54.79,22.16 | 54.79,22.16 54.85,22.23 54.85,22.73 54.35,23.24 53.84,23.24 53.33,22.73 MCU.6 | 65.27,20.95 56.38,20.95 55.23,22.1 54.85,22.1 54.79,22.16 | v62.6,10.92 61.65,11.87 | 61.65,11.87 60.95,12.57 60.95,13.21 R_RESET.2 | 65.27,5.84 65.27,4.7 66.16,3.81 H1.7 | 65.27,5.84 v65.27,7.49 | v65.27,20.19 65.27,20.95 | v61.71,14.61 61.71,11.94 61.65,11.87 | 30.6,14.73 30.6,14.48 32.25,12.83 49.65,12.83 49.96,13.14 | 30.6,14.73 30.6,15.75 C14.A1 | ISP.2 16.75,42.16 15.61,43.31 14.47,43.31 13.71,42.55 13.71,31.37 22.85,22.23 22.85,16 24.12,14.73 30.6,14.73
  Top 0.203: 65.27,5.84 60.82,5.84 57.52,9.14 53.97,9.14 49.96,13.14
  Top 0.305: 82.92,29.72 82.92,26.54 83.17,26.29 83.81,26.29 84.32,25.65 87.24,25.65
  Bottom 0.203: v62.6,10.92 62.6,10.16 v65.27,7.49 | v65.27,20.19 65.27,18.16 v61.71,14.61 | 97.02,27.69 CN1.1 | 87.37,25.65 J1.PWR
  Bottom 0.305: 97.02,27.69 94.73,27.69 94.22,28.19 91.68,28.19 89.14,25.65 87.37,25.65
VCL  (via drill 0.3)
  Top 0.203: RN2.6 49.01,15.11 49.01,15.75 RN2.5 49.14,15.88 49.77,16.51 54.47,16.51 v55.49,17.53 | 73.02,35.05 72.63,35.05 CLOCK.5 73.02,35.05 | 73.02,35.05 74.41,35.05 C_LDO_CLOCK.2 | 73.02,35.05 73.02,37.85 70.6,40.26 63.36,40.26 v59.3,36.2 | v63.24,29.46 63.24,27.56 59.55,23.88 | 59.55,23.88 58.92,23.24 U1.2 | 59.55,23.88 v59.17,24.26
  Bottom 0.203: v59.3,36.2 59.3,34.92 58.92,34.54 58.92,33.02 62.47,29.46 v63.24,29.46 | v55.49,17.53 55.49,18.29 54.6,19.18 54.6,19.68 v59.17,24.26
VDD  (via drill 0.3)
  Top 0.203: Q4.1 75.55,13.34 74.92,12.7 73.78,12.7 73.14,13.34 72.63,13.34 Q3.1 72.51,13.46 72.51,13.72 70.47,15.75 v70.22,15.75 | C_LDO_SD.2 67.68,35.56 65.9,35.56 LD0_SD.5 65.78,35.56 64.89,34.67 64.89,34.04 63.87,33.02 v61.84,33.02 | v60.32,34.16 57.65,36.83 57.65,40.39 56.12,41.91 44.44,41.91 43.68,41.15 43.68,39.88 39.23,35.43 LSHIFT.1 39.23,31.75 39.87,31.11 v39.87,29.08 | 28.37,21.65 26.91,23.11 26.41,23.11 SD.4 | 28.37,21.65 28.69,21.34 28.69,18.41 30.22,16.89 30.6,16.89 31.23,16.26 31.23,15.88 C14.B1 | 28.37,21.65 30.98,24.26 30.98,26.8 32.25,28.07 v38.85,28.07
  Bottom 0.203: v70.22,15.75 70.22,24.64 v61.84,33.02 60.7,34.16 v60.32,34.16 | v39.87,29.08 v38.85,28.07
VUSB  (via drill 0.3)
  Top 0.203: RN1.6 86.86,4.19 86.86,4.83 RN1.5 86.86,4.95 86.86,8.38 86.1,9.14 86.1,12.45 87.49,13.84 JP5.VBUS | 80.06,20.64 81.27,21.84 C21.A 81.14,21.84 81.14,25.4 C17.1 81.02,25.4 80.25,26.16 Q2.3 | 80.06,20.64 78.86,19.43 78.86,18.8 U2.12 | v81.52,19.18 80.06,20.64
  Bottom 0.203: v81.52,19.18 86.73,13.97 87.49,13.97 JP5.VBUS
X0
  Top 0.203: XTAL.2 59.55,25.53 CX0.2 59.43,25.53 58.54,24.64 54.6,24.64 53.2,23.24 52.77,23.24 MCU.7
X1
  Top 0.203: 54.73,25.53 54.6,25.53 52.82,23.75 MCU.8 | XTAL.1 54.73,25.53 | 54.73,25.53 CX1.2

### Text on the board
tPlace: TM | MISO | MOSI | SCK | VCC | 3V3 | 5V | GND | D7 | 1 | TM | TM | A0 | A1 | A2 | A3 | A6 | A7 | v. 1.4.1 / 09 August 2016 / Andy Wickert / Chad Sandell / University of Minnesota | GND | A0 | 3V3 | A1 | 3V3 | A2 | GND | A3 | 3V3 | A6 | 3V3 | A7 | D3- / INT1 | 5V | VCC | GND | RX | TX | SDA | SCL | Rx | Tx